# EAGLE design usb_dcdc_12v_power (EAGLE 8.3.1)
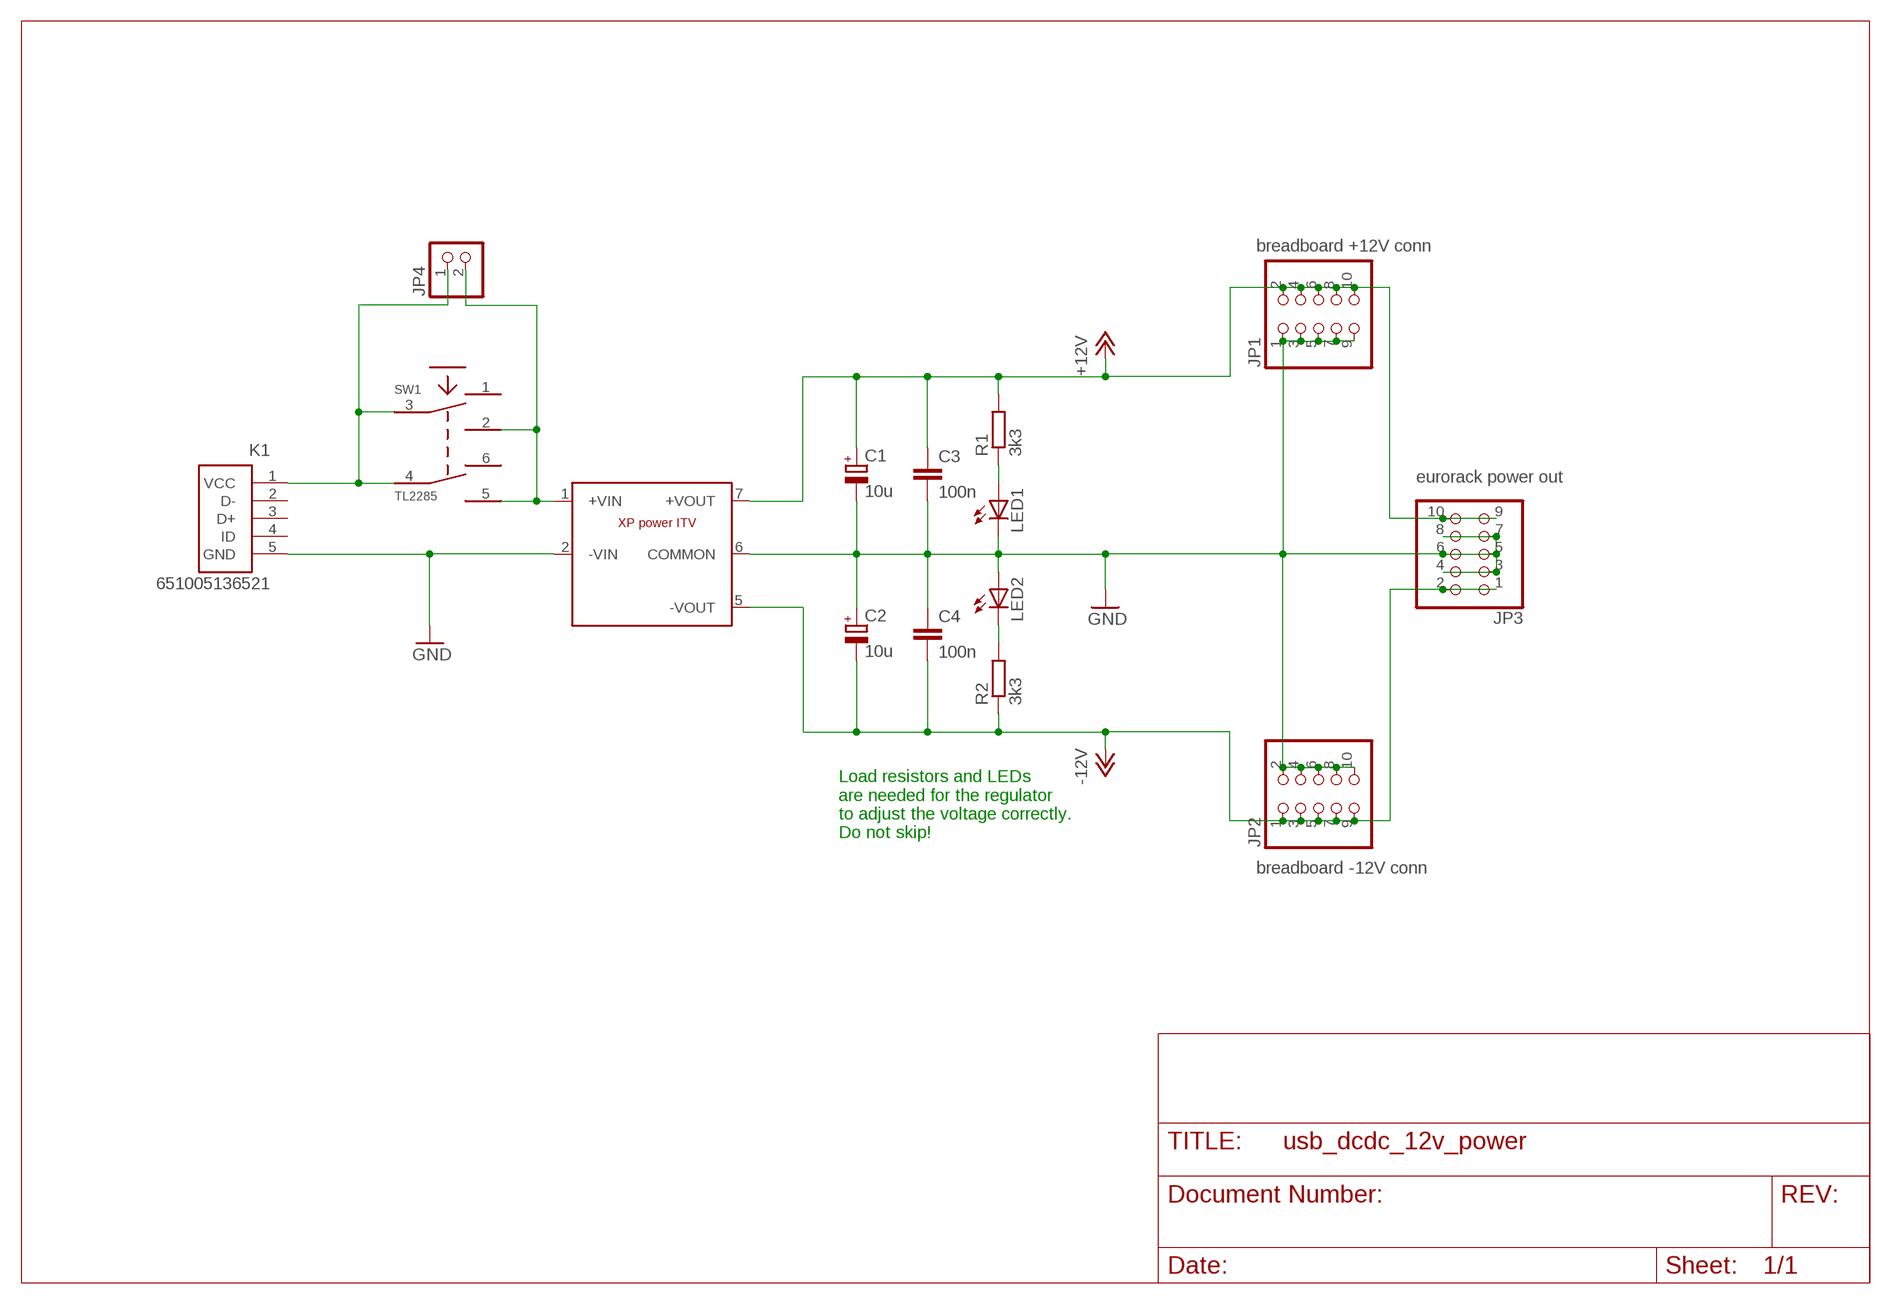
[diagram p0: schematic, sheet 1]

## Parts
C1  10u  CPOL-EUE2.5-5  [E2,5-5]
C2  10u  CPOL-EUE2.5-5  [E2,5-5]
C3  100n  C-EU025-025X050  [C025-025X050]
C4  100n  C-EU025-025X050  [C025-025X050]
JP1  breadboard +12V conn  PINHD-2X5  [2X05]
JP2  breadboard -12V conn  PINHD-2X5  [2X05]
JP3  eurorack power out  PINHD-2X5  [2X05]
JP4  PINHD-1X2  [1X02]
K1  651005136521  [651005136521]
LED1  LED3MM  [LED3MM]
LED2  LED3MM  [LED3MM]
R1  3k3  R-EU_0207/2V  [0207/2V]
R2  3k3  R-EU_0207/2V  [0207/2V]
SW1  TL2285  [TL2285_PCB]
U$1  XP_POWER_ITV  [DC_CONV_SIP_STD]

## Nets
+12V: C1.+ C3.1 JP1.2 JP1.4 JP1.6 JP1.8 JP1.10 JP3.9 JP3.10 R1.2 U$1.7(+VOUT)
-12V: C2.- C4.2 JP2.1 JP2.3 JP2.5 JP2.7 JP2.9 JP3.1 JP3.2 R2.1 U$1.5(-VOUT)
GND: C1.- C2.+ C3.2 C4.1 JP1.1 JP1.3 JP1.5 JP1.7 JP1.9 JP2.2 JP2.4 JP2.6 JP2.8 JP2.10 JP3.3 JP3.4 JP3.5 JP3.6 JP3.7 JP3.8 K1.5(GND) LED1.K(C) LED2.A U$1.2(-VIN) U$1.6(COMMON)
N$1: JP4.2 SW1.2 SW1.5 U$1.1(+VIN)
N$3: JP4.1 K1.1(VCC) SW1.3 SW1.4
N$7: LED1.A R1.1
N$8: LED2.K(C) R2.2
Unconnected: K1.2(D-) K1.3(D+) K1.4(ID) SW1.1 SW1.6

## Notes on the sheet
- Load resistors and LEDs
  are needed for the regulator
  to adjust the voltage correctly.
  Do not skip!

## Library data of the parts
C1 C2 = rcl:CPOL-EU: POLARIZED CAPACITOR, European symbol
C3 C4 = rcl:C-EU: CAPACITOR, European symbol
JP1-JP3 = pinhead:PINHD-2X5: PIN HEADER
JP4 = pinhead:PINHD-1X2: PIN HEADER
K1 = Wuerth_Elektronik_eiCan_Communication_Connectors_STENCIL:651005136521: WR-COM Horizontal 5 Contacts Mini USB Typ B
LED1 LED2 = led:LED: LED OSRAM: - CHIPLED LG R971, LG N971, LY N971, LG Q971, LY Q971, LO R971, LY R971 LH N974, LH R974 LS Q976, LO Q976, LY Q976 LO Q996 - Hyper CHIPLED LW Q18S LB Q993, LB Q99A, LB R99A - SideLED LS A670, LO A670, LY A670, LG A670, LP A670 LB A673, LV A673, LT A673, LW A673 LH A674 LY A675 LS A676, LA A676, LO A676, LY A676, LW A676 LS A679, LY A679, LG A679 - Hyper Micro SIDELED® LS Y876, LA Y876, LO Y876, LY Y876 LT Y87S - SmartLED LW L88C, LW L88S LB L89C, LB L89S, LG L890 LS L89K, LO L89K, LY L89K LS L896, LA L896, LO L896, LY L896 - TOPLED LS T670, LO T670, LY T670, LG T670, LP T670 LSG T670, LSP T670, LSY T670, LOP T670, LYG T670 LG T671, LOG T671, LSG T671 LB T673, LV T673, LT T673, LW T673 LH T674 LS T676, LA T676, LO T676, LY T676, LB T676, LH T676, LSB T676, LW T676 LB T67C, LV T67C, LT T67C, LS T67K, LO T67K, LY T67K, LW E67C LS E67B, LA E67B, LO E67B, LY E67B, LB E67C, LV E67C, LT E67C LW T67C LS T679, LY T679, LG T679 LS T770, LO T770, LY T770, LG T770, LP T770 LB T773, LV T773, LT T773, LW T773 LH T774 LS E675, LA E675, LY E675, LS T675 LS T776, LA T776, LO T776, LY T776, LB T776 LHGB T686 LT T68C, LB T68C - Hyper Mini TOPLED® LB M676 - Mini TOPLED Santana® LG M470 LS M47K, LO M47K, LY M47K Source: http://www.osram.convergy.de LUXEON: - LUMILED® LXK2-PW12-R00, LXK2-PW12-S00, LXK2-PW14-U00, LXK2-PW14-V00 LXK2-PM12-R00, LXK2-PM12-S00, LXK2-PM14-U00 LXK2-PE12-Q00, LXK2-PE12-R00, LXK2-PE12-S00, LXK2-PE14-T00, LXK2-PE14-U00 LXK2-PB12-K00, LXK2-PB12-L00, LXK2-PB12-M00, LXK2-PB14-N00, LXK2-PB14-P00, LXK2-PB14-Q00 LXK2-PR12-L00, LXK2-PR12-M00, LXK2-PR14-Q00, LXK2-PR14-R00 LXK2-PD12-Q00, LXK2-PD12-R00, LXK2-PD12-S00 LXK2-PH12-R00, LXK2-PH12-S00 LXK2-PL12-P00, LXK2-PL12-Q00, LXK2-PL12-R00 Source: www.luxeon.com KINGBRIGHT: KA-3528ASYC Source: www.kingbright.com
R1 R2 = rcl:R-EU_: RESISTOR, European symbol
SW1 = L71_devices:TL2285: E-Switch TL2285 (PCB switch)
U$1 = L71_devices:XP_POWER_ITV

## Board
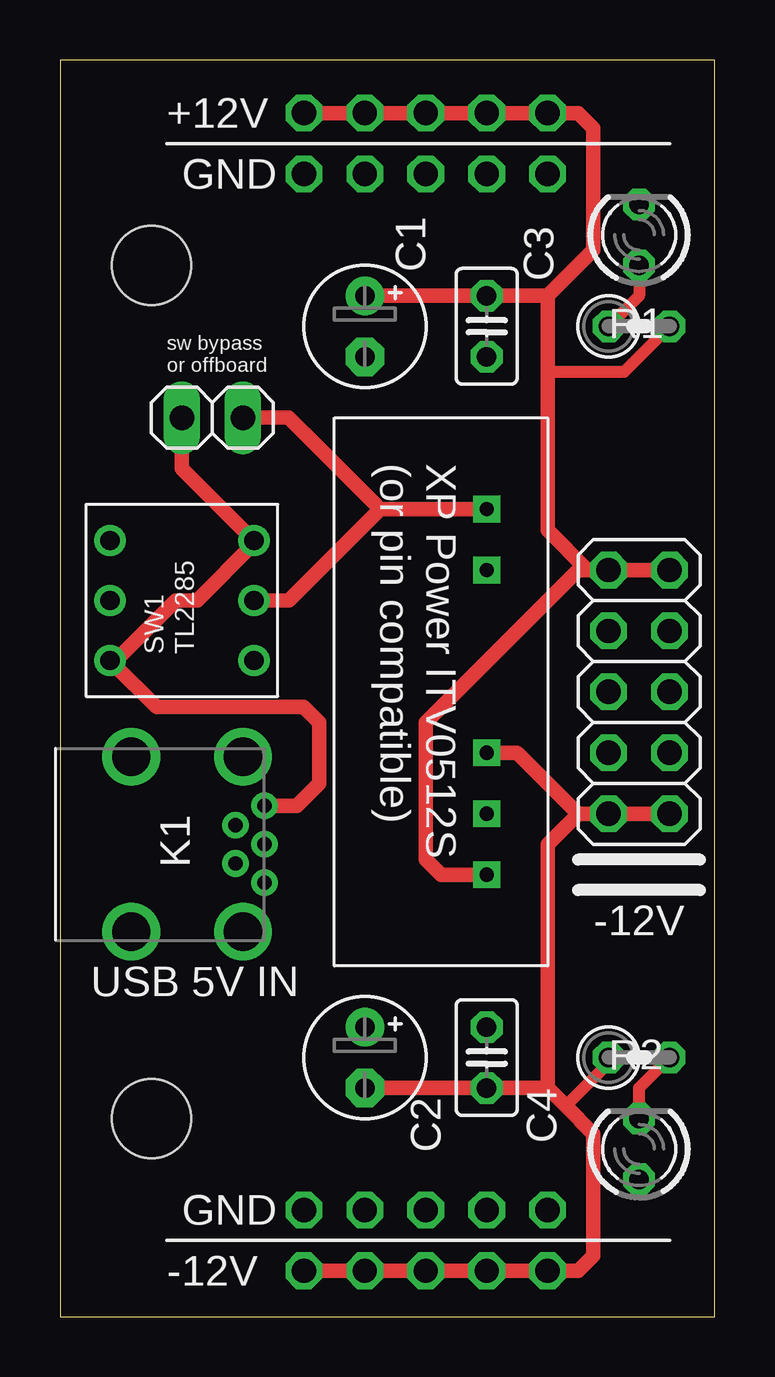
[diagram p1: board, top side]
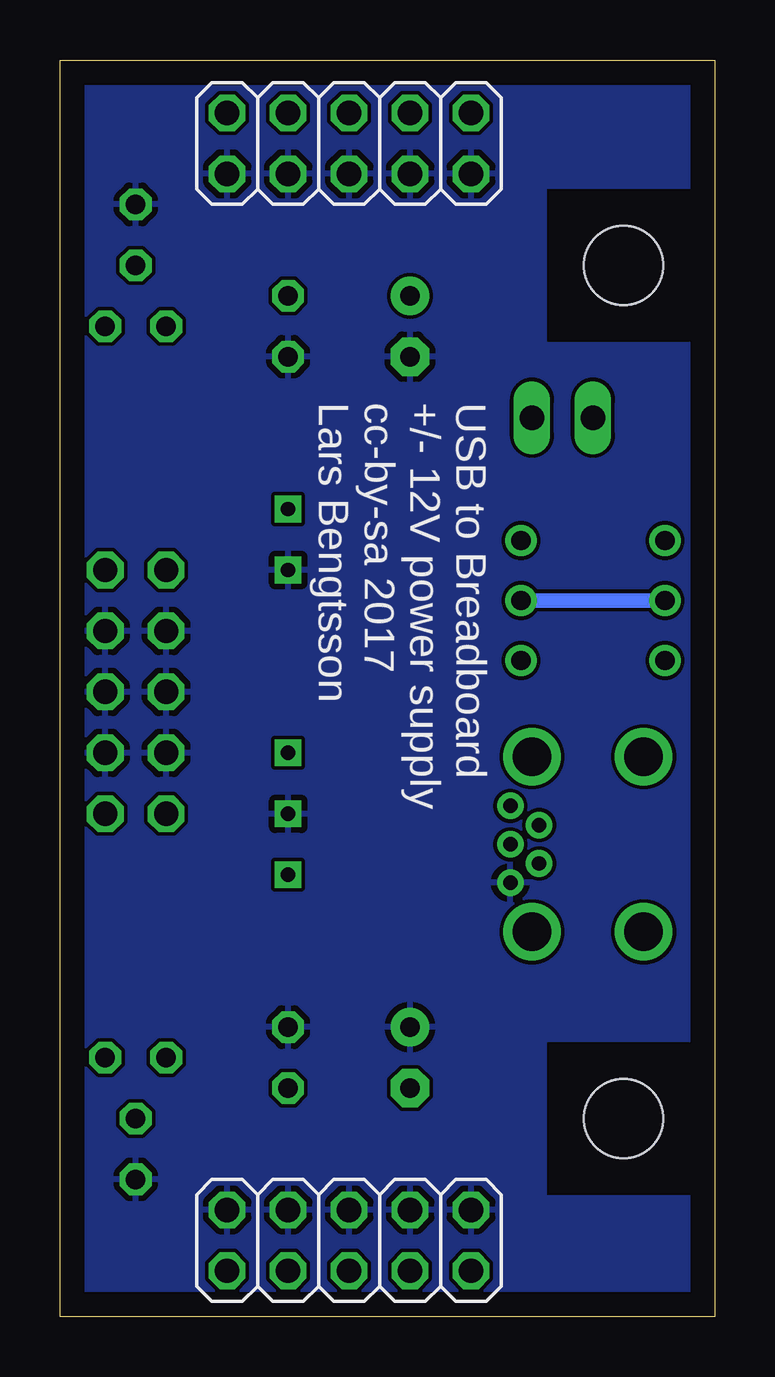
[diagram p2: board, bottom side, seen from below]

Size 27.29 x 52.38 mm. Coordinates in mm from the lower left corner, seen from the top.
Outline: 0,0 27.29,0 27.29,52.38 0,52.38 0,0
Copper layers (1*16): Top 0.035mm / dielectric 1.5mm / Bottom 0.035mm
Design rules "default": minimum track width 6mil, minimum drill 0.35mm, track to track 6mil, track to pad 6mil, pad to pad 6mil, via to via 6mil, smd to smd 6mil, copper to edge 40mil, drill to drill 6mil, minimum pad ring 10mil, minimum via ring 8mil, stop-mask expansion 4mil, vias tented up to drill 0mil, thermal gap 10mil
Holes 3.3 mm at 3.81,43.82 3.81,8.25
bRestrict: area 0.6,40.6 to 7,47; area 0.6,5.1 to 7,11.4

### Footprints (pad centres in the part's own frame; a part is rotated, then mirrored left to right if it is on the bottom)
E2,5-5 = drill 0.813 pad 1.6: + -1.27,0 | drill 0.813 pad 1.6 octagon: - 1.27,0
C025-025X050 = drill 0.813 octagon: 1 -1.27,0; 2 1.27,0
2X05 = drill 1.016 octagon: 1 -5.08,-1.27; 2 -5.08,1.27; 3 -2.54,-1.27; 4 -2.54,1.27; 5 0,-1.27; 6 0,1.27; 7 2.54,-1.27; 8 2.54,1.27; 9 5.08,-1.27; 10 5.08,1.27
1X02 = drill 1.016 long: 1 -1.27,0; 2 1.27,0
651005136521 = drill 0.6: 1 1.6,-0.9; 2 0.8,0.3; 3 0,-0.9; 4 -0.8,0.3; 5 -1.6,-0.9 | drill 1.6: 6 -3.65,0; 7 -3.65,4.65; 8 3.65,4.65; 9 3.65,0
LED3MM = drill 0.813 octagon: A -1.27,0; K 1.27,0
0207/2V = drill 0.813 octagon: 1 -1.27,0; 2 1.27,0
TL2285_PCB = drill 0.8: 1 -2.5,-3; 2 0,-3; 3 2.5,-3; 4 -2.5,3; 5 0,3; 6 2.5,3
DC_CONV_SIP_STD = drill 0.6 square: 1 -8.89,0; 2 -6.35,0; 5 1.27,0; 6 3.81,0; 7 6.35,0

### Placement (x,y rotation side)
C1  12.7,41.28 270 top
C2  12.7,10.79 270 top
C3  17.78,41.28 270 top
C4  17.78,10.79 270 top
JP1  15.24,48.9 0 bottom
JP2  15.24,3.18 0 bottom
JP3  24.13,26.04 90 top
JP4  6.35,37.47 0 top
K1  7.62,19.68 90 top
LED1  24.13,45.09 90 top
LED2  24.13,6.99 90 top
R1  24.13,41.28 0 top
R2  24.13,10.79 0 top
SW1  5.08,29.85 90 top
U$1  17.78,24.77 270 top

### Tracks (layer width: path | path; a pad name or v marks a point on that pad's centre or on a via)
+12V
  Top 0.508: R1.2 23.5,39.37 20.36,39.37 20.32,39.41
  Top 0.61: JP3.9 JP3.10 22.79,31.11 | 22.79,31.11 21.98,31.11 | 21.98,31.11 21.59,31.11 15.24,24.77 15.24,19.05 15.88,18.42 U$1.7 | C1.+ C3.1 20.32,42.55 | 20.32,42.55 22.23,44.45 22.23,49.53 21.59,50.17 JP1.2 JP1.4 JP1.6 JP1.8 JP1.10 | 20.32,42.55 20.32,39.41 20.32,32.77 21.98,31.11 | 22.86,31.19 22.79,31.11
-12V
  Top 0.508: R2.1 22.86,10.57 21.07,8.78
  Top 0.61: JP3.1 JP3.2 21.59,20.96 | 21.59,20.96 19.05,23.5 U$1.5 | 20.32,9.53 21.07,8.78 22.23,7.62 22.23,2.54 21.59,1.91 JP2.1 JP2.3 JP2.5 JP2.7 JP2.9 | 20.32,9.53 C4.2 C2.- | 20.32,9.53 20.32,19.68 21.59,20.96
GND
  pour Bottom: 0.64,51.44 26.67,51.44 26.67,0.64 0.64,0.64
N$1
  Top 0.61: SW1.2 9.53,29.85 13.34,33.66 | 13.34,33.66 U$1.1 | JP4.2 9.53,37.47 13.34,33.66
  Bottom 0.61: SW1.5 SW1.2
N$3
  Top 0.61: K1.1 9.86,21.29 10.79,22.23 10.79,24.77 10.16,25.4 4.03,25.4 2.2,27.23 | 2.2,27.23 SW1.4 | 2.2,27.23 4.82,29.85 5.71,29.85 8.08,32.21 SW1.3 5.08,35.34 JP4.1
N$7
  Top 0.508: LED1.A 24.13,42.55 R1.1
N$8
  Top 0.508: LED2.K 24.13,9.53 R2.2

### Text on the board
tNames: +12V | GND | sw bypass / or offboard | XP Power ITV0512S / (or pin compatible) | -12V | USB 5V IN | GND | -12V
bNames: USB to Breadboard / +/- 12V power supply / cc-by-sa 2017 / Lars Bengtsson